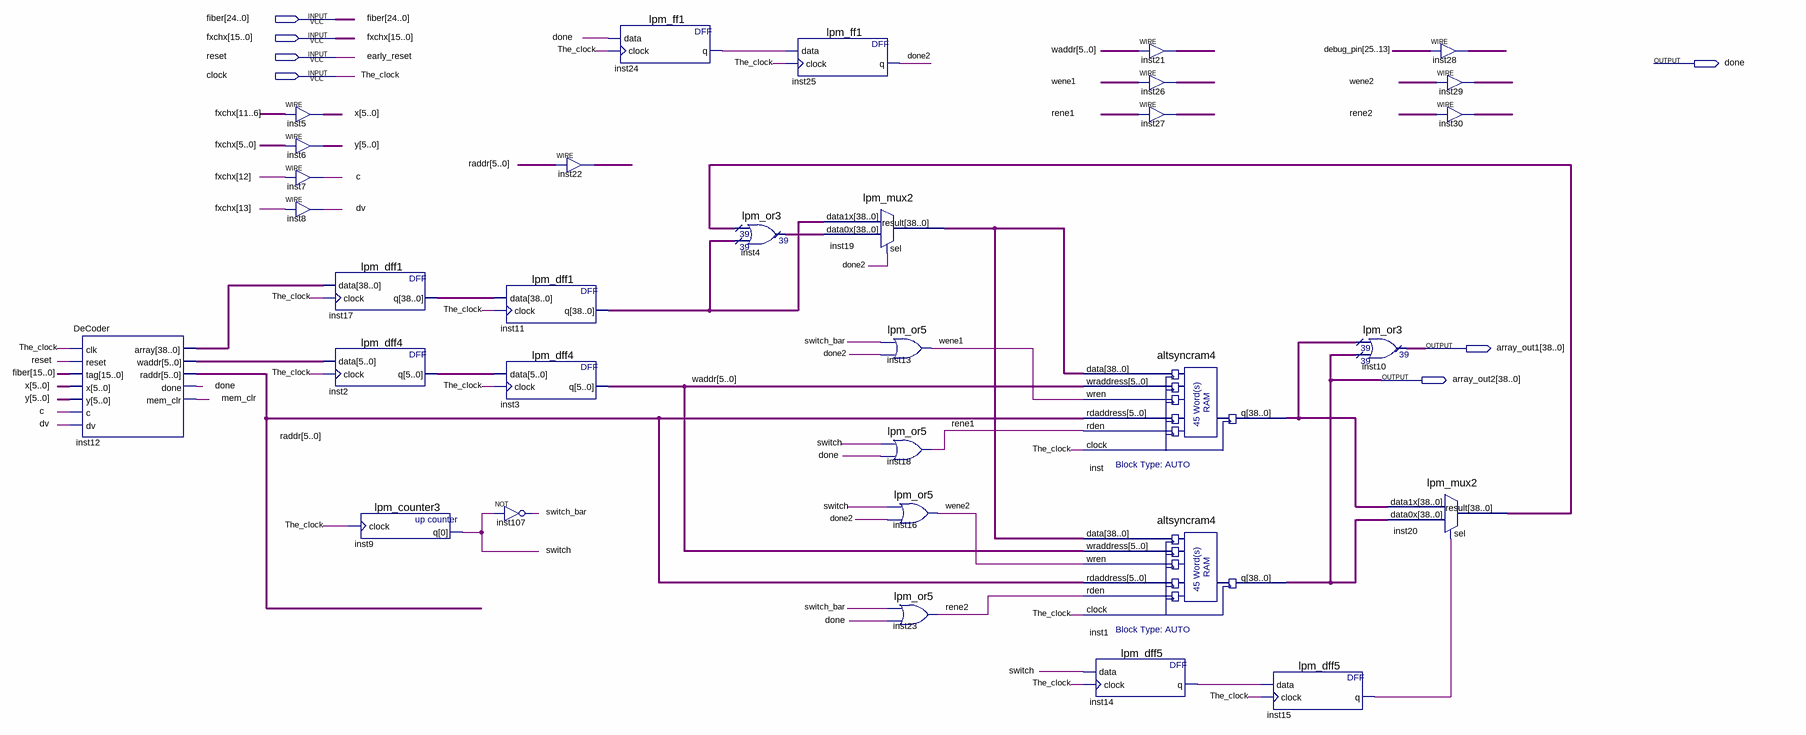
[diagram p0: schematic sheet]
// Quartus schematic mapping_block2.bdf as structural Verilog: 32 symbols, 7 pins
module mapping_block2 (
  input  [24:0] fiber,
  input  [15:0] fxchx,
  input  reset,
  input  clock,
  output done,
  output [38:0] array_out1,
  output [38:0] array_out2
);

  wire c, done2, dv, inst14_q, inst15_q, inst24_q, inst26_out, inst27_out, inst29_out, inst30_out, mem_clr,
       rene1, rene2, switch, switch_bar, wene1, wene2;
  wire [5:0] inst2_q, inst12_waddr, inst21_out, inst22_out, raddr, waddr, x, y;
  wire [12:0] inst28_out;
  wire [25:13] debug_pin;
  wire [38:0] inst4_result, inst11_q, inst12_array, inst17_q, inst19_result, inst20_result, inst_q;

  DeCoder inst12 (
    .clk(clock), .reset(reset), .tag(fiber[15:0]), .x(x), .y(y), .c(c), .dv(dv), .array(inst12_array),
    .waddr(inst12_waddr), .raddr(raddr), .done(done), .mem_clr(mem_clr));
  assign x = fxchx[11:6];  // WIRE inst5
  assign y = fxchx[5:0];  // WIRE inst6
  assign c = fxchx[12];  // WIRE inst7
  assign dv = fxchx[13];  // WIRE inst8
  lpm_dff1 inst17 (.data(inst12_array), .clock(clock), .q(inst17_q));
  lpm_dff4 inst2 (.data(inst12_waddr), .clock(clock), .q(inst2_q));
  lpm_counter3 inst9 (.clock(clock), .q(switch));
  lpm_dff1 inst11 (.data(inst17_q), .clock(clock), .q(inst11_q));
  lpm_dff4 inst3 (.data(inst2_q), .clock(clock), .q(waddr));
  not inst107 (switch_bar, switch);
  assign inst22_out = raddr;  // WIRE inst22
  lpm_ff1 inst24 (.data(done), .clock(clock), .q(inst24_q));
  lpm_or3 inst4 (.data0x(inst20_result), .data1x(inst11_q), .result(inst4_result));
  lpm_ff1 inst25 (.data(inst24_q), .clock(clock), .q(done2));
  lpm_mux2 inst19 (.data1x(inst11_q), .data0x(inst4_result), .sel(done2), .result(inst19_result));
  lpm_or5 inst13 (.data0(switch_bar), .data1(done2), .result(wene1));
  lpm_or5 inst18 (.data0(switch), .data1(done), .result(rene1));
  lpm_or5 inst16 (.data0(switch), .data1(done2), .result(wene2));
  lpm_or5 inst23 (.data0(switch_bar), .data1(done), .result(rene2));
  altsyncram4 inst (
    .data(inst19_result), .wraddress(waddr), .wren(wene1), .rdaddress(raddr), .rden(rene1), .clock(clock),
    .q(inst_q));
  altsyncram4 inst1 (
    .data(inst19_result), .wraddress(waddr), .wren(wene2), .rdaddress(raddr), .rden(rene2), .clock(clock),
    .q(array_out2));
  lpm_dff5 inst14 (.data(switch), .clock(clock), .q(inst14_q));
  assign inst21_out = waddr;  // WIRE inst21
  assign inst26_out = wene1;  // WIRE inst26
  assign inst27_out = rene1;  // WIRE inst27
  lpm_dff5 inst15 (.data(inst14_q), .clock(clock), .q(inst15_q));
  lpm_or3 inst10 (.data0x(inst_q), .data1x(array_out2), .result(array_out1));
  lpm_mux2 inst20 (.data1x(inst_q), .data0x(array_out2), .sel(inst15_q), .result(inst20_result));
  assign inst28_out = debug_pin;  // WIRE inst28
  assign inst29_out = wene2;  // WIRE inst29
  assign inst30_out = rene2;  // WIRE inst30

  // Other names for the same wires on the sheet: early_reset = reset; The_clock = clock
endmodule
